# EAGLE schematic io (EAGLE 5.12)

## Sheet 1 of 6
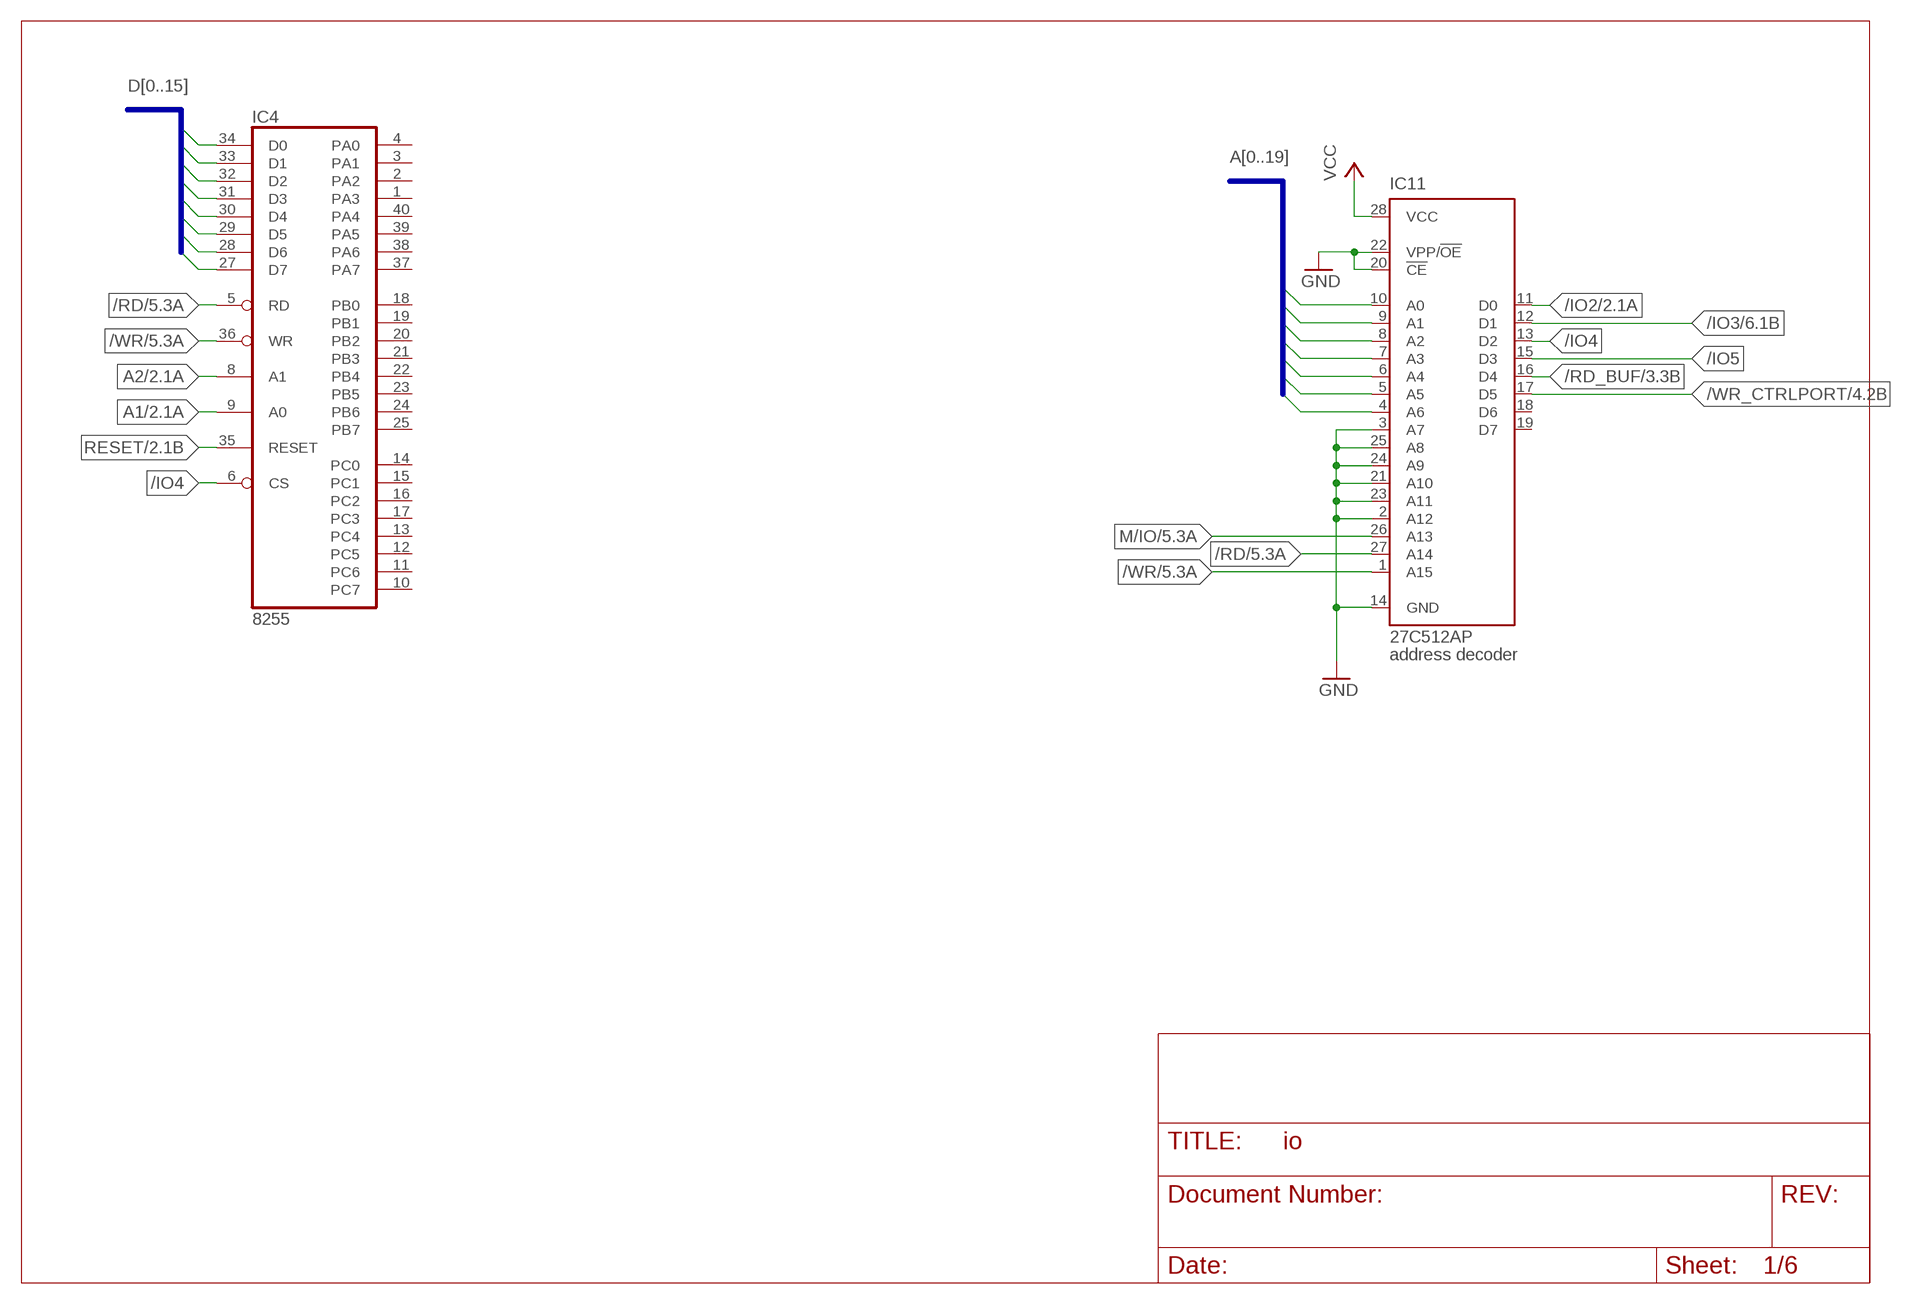
[diagram p0: schematic, sheet 1]

### Parts
IC4  8255  8255A  [DIL40]
IC11  27C512AP  [DIL28-6]

### Nets
/IO2: IC11.11(D0) ; also sheet 2
/IO3: IC11.12(D1) ; also sheet 6
/IO4: IC4.6(CS) IC11.13(D2)
/IO5: IC11.15(D3)
/RD: IC4.5(RD) IC11.27(A14) ; also sheet 5,6
/RD_BUF: IC11.16(D4) ; also sheet 3
/WR: IC4.36(WR) IC11.1(A15) ; also sheet 5,6
/WR_CTRLPORT: IC11.17(D5) ; also sheet 4
A1: IC4.9(A0) ; also sheet 2,3,5,6
A2: IC4.8(A1) ; also sheet 2,3,5
A3: IC11.10(A0) ; also sheet 2,3,5
A4: IC11.9(A1) ; also sheet 3,5
A5: IC11.8(A2) ; also sheet 3,5
A6: IC11.7(A3) ; also sheet 3,5
A7: IC11.6(A4) ; also sheet 3,5
A8: IC11.5(A5) ; also sheet 3,5
A9: IC11.4(A6) ; also sheet 5
D0: IC4.34(D0) ; also sheet 2,3,4,5,6
D1: IC4.33(D1) ; also sheet 2,3,4,5,6
D2: IC4.32(D2) ; also sheet 2,3,4,5,6
D3: IC4.31(D3) ; also sheet 2,3,4,5,6
D4: IC4.30(D4) ; also sheet 2,3,4,5,6
D5: IC4.29(D5) ; also sheet 2,3,4,5,6
D6: IC4.28(D6) ; also sheet 2,3,4,5,6
D7: IC4.27(D7) ; also sheet 2,3,4,5,6
GND: IC11.2(A12) IC11.3(A7) IC11.14(GND) IC11.20(!CE) IC11.21(A10) IC11.22(VPP/!OE) IC11.23(A11) IC11.24(A9) IC11.25(A8) ; also sheet 3,4,5,6
M/IO: IC11.26(A13) ; also sheet 5
RESET: IC4.35(RESET) ; also sheet 2,5,6
VCC: IC11.28(VCC) ; also sheet 3,4,5,6
Unconnected: IC4.1(PA3) IC4.2(PA2) IC4.3(PA1) IC4.4(PA0) IC4.10(PC7) IC4.11(PC6) IC4.12(PC5) IC4.13(PC4) IC4.14(PC0) IC4.15(PC1) IC4.16(PC2) IC4.17(PC3) IC4.18(PB0) IC4.19(PB1) IC4.20(PB2) IC4.21(PB3) IC4.22(PB4) IC4.23(PB5) IC4.24(PB6) IC4.25(PB7) IC4.37(PA7) IC4.38(PA6) IC4.39(PA5) IC4.40(PA4) IC11.18(D6) IC11.19(D7)

### Buses
A[0..19]
D[0..15]

### Notes on the sheet
- address decoder

## Sheet 2 of 6
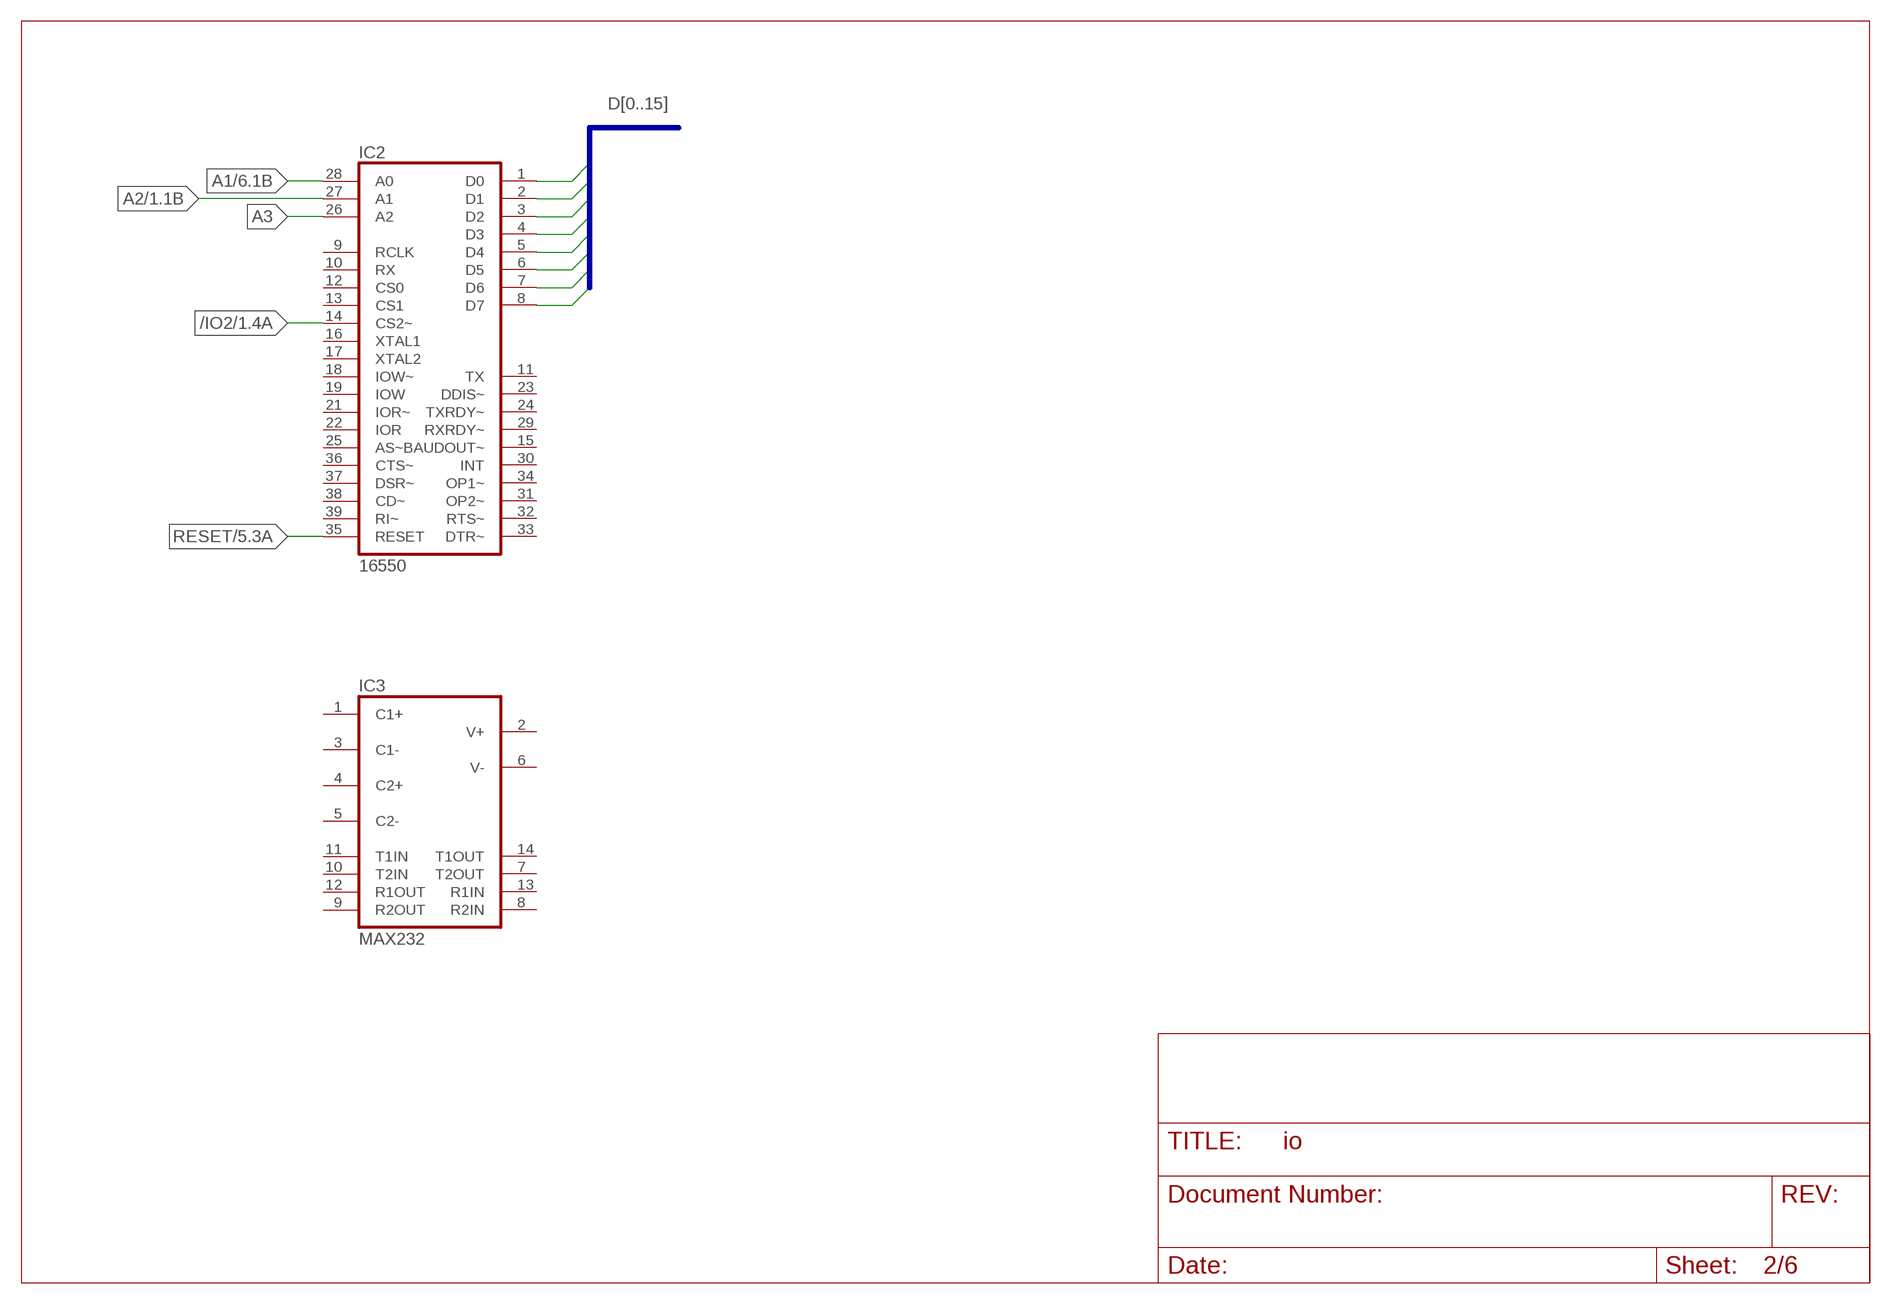
[diagram p1: schematic, sheet 2]

### Parts
IC2  16550  XR-16C550P  [DIL40]
IC3  MAX232  [DIL16]

### Nets
/IO2: IC2.14(CS2~) ; also sheet 1
A1: IC2.28(A0) ; also sheet 1,3,5,6
A2: IC2.27(A1) ; also sheet 1,3,5
A3: IC2.26(A2) ; also sheet 1,3,5
D0: IC2.1(D0) ; also sheet 1,3,4,5,6
D1: IC2.2(D1) ; also sheet 1,3,4,5,6
D2: IC2.3(D2) ; also sheet 1,3,4,5,6
D3: IC2.4(D3) ; also sheet 1,3,4,5,6
D4: IC2.5(D4) ; also sheet 1,3,4,5,6
D5: IC2.6(D5) ; also sheet 1,3,4,5,6
D6: IC2.7(D6) ; also sheet 1,3,4,5,6
D7: IC2.8(D7) ; also sheet 1,3,4,5,6
RESET: IC2.35(RESET) ; also sheet 1,5,6
Unconnected: IC2.9(RCLK) IC2.10(RX) IC2.11(TX) IC2.12(CS0) IC2.13(CS1) IC2.15(BAUDOUT~) IC2.16(XTAL1) IC2.17(XTAL2) IC2.18(IOW~) IC2.19(IOW) IC2.21(IOR~) IC2.22(IOR) IC2.23(DDIS~) IC2.24(TXRDY~) IC2.25(AS~) IC2.29(RXRDY~) IC2.30(INT) IC2.31(OP2~) IC2.32(RTS~) IC2.33(DTR~) IC2.34(OP1~) IC2.36(CTS~) IC2.37(DSR~) IC2.38(CD~) IC2.39(RI~) IC3.1(C1+) IC3.2(V+) IC3.3(C1-) IC3.4(C2+) IC3.5(C2-) IC3.6(V-) IC3.7(T2OUT) IC3.8(R2IN) IC3.9(R2OUT) IC3.10(T2IN) IC3.11(T1IN) IC3.12(R1OUT) IC3.13(R1IN) IC3.14(T1OUT)

### Buses
D[0..15]

## Sheet 3 of 6
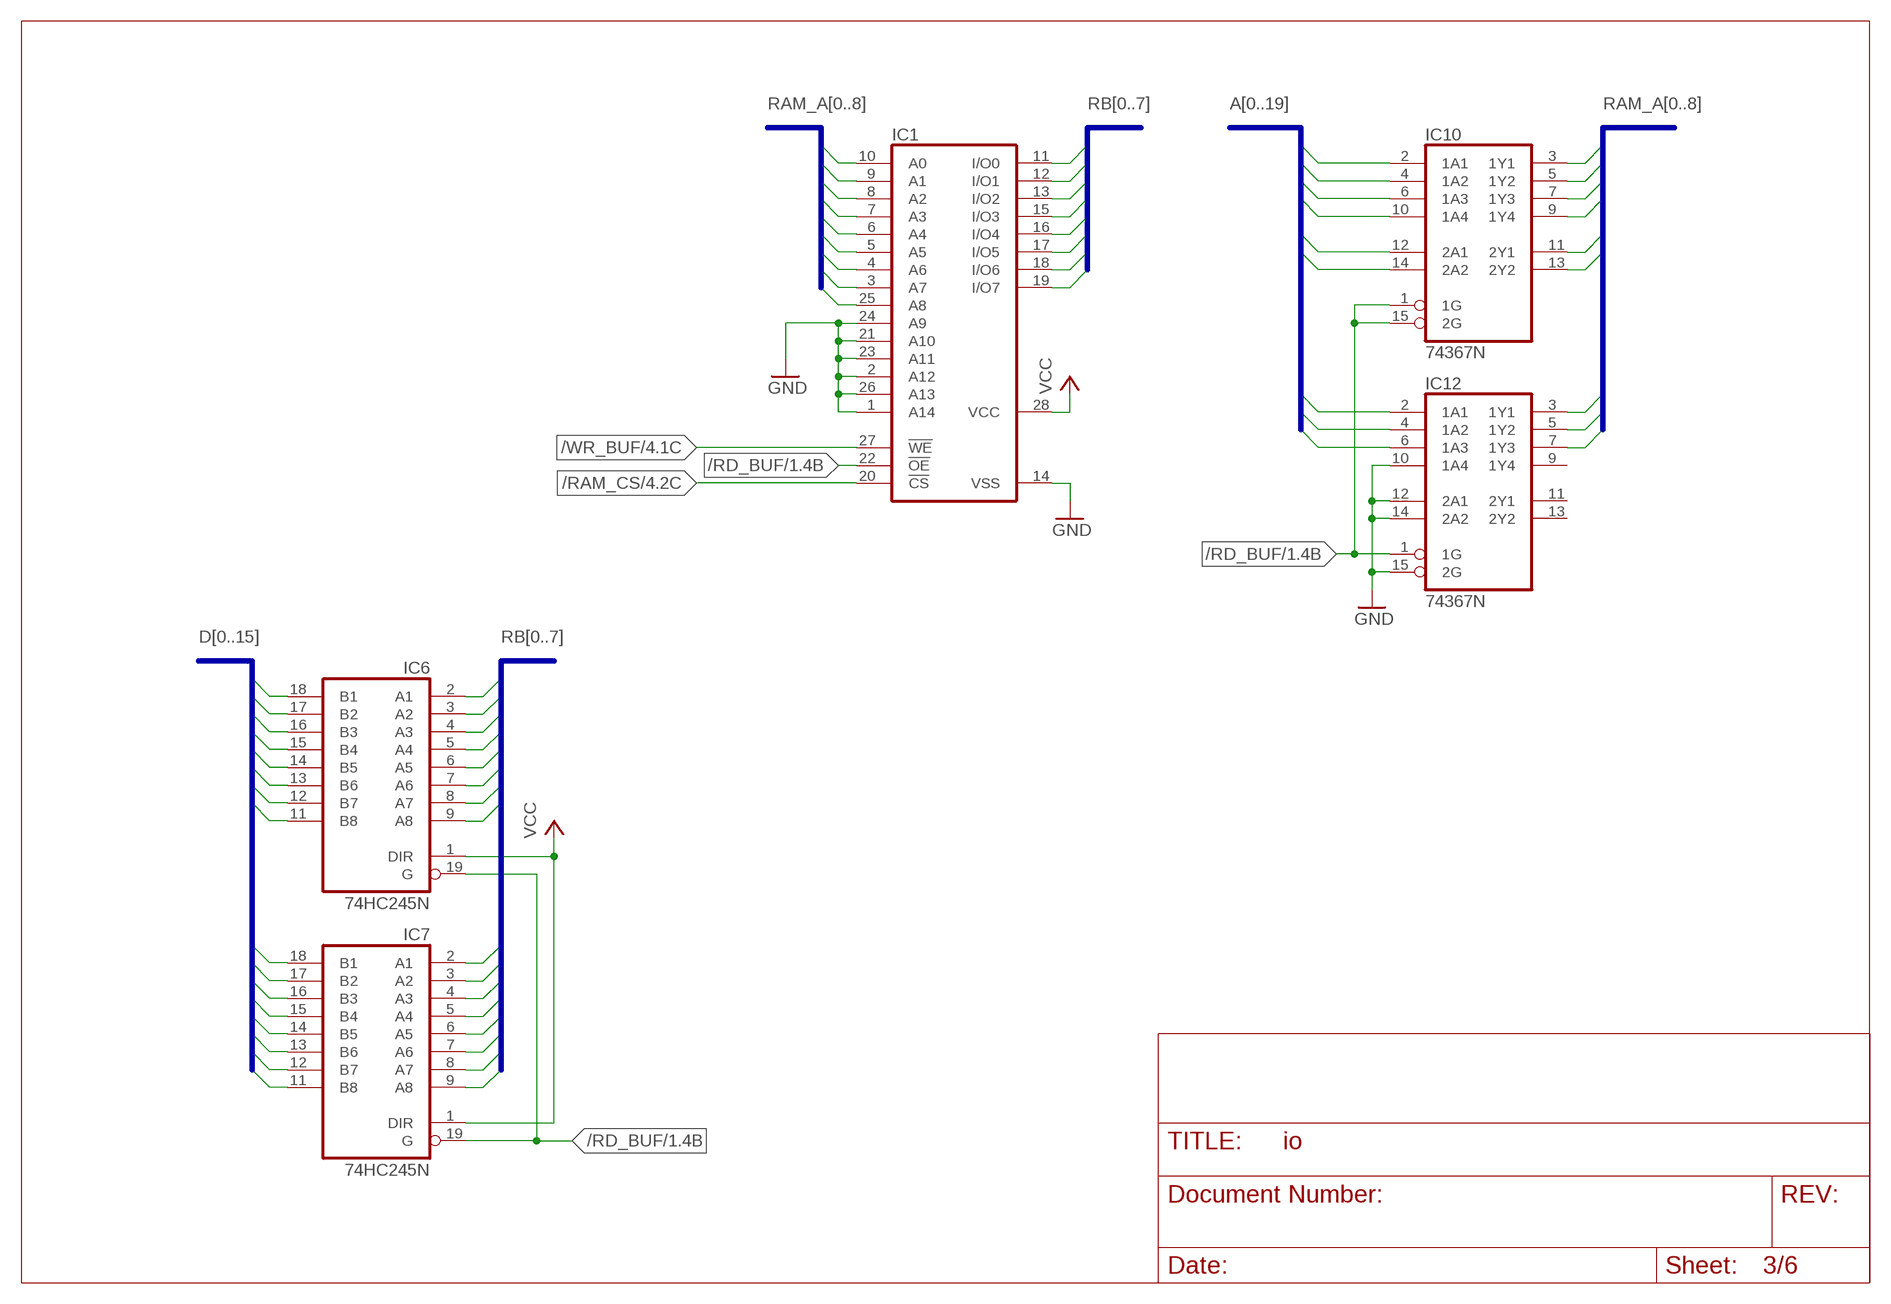
[diagram p2: schematic, sheet 3]

### Parts
IC1  62832P  [DIL28-3]
IC6  74HC245N  [DIL20]
IC7  74HC245N  [DIL20]
IC10  74367N  [DIL16]
IC12  74367N  [DIL16]

### Nets
/RAM_CS: IC1.20(!CS) ; also sheet 4
/RD_BUF: IC1.22(!OE) IC6.19(G) IC7.19(G) IC10.1(1G) IC10.15(2G) IC12.1(1G) ; also sheet 1
/WR_BUF: IC1.27(!WE) ; also sheet 4
A0: IC10.2(1A1) ; also sheet 5
A1: IC10.4(1A2) ; also sheet 1,2,5,6
A2: IC10.6(1A3) ; also sheet 1,2,5
A3: IC10.10(1A4) ; also sheet 1,2,5
A4: IC10.12(2A1) ; also sheet 1,5
A5: IC10.14(2A2) ; also sheet 1,5
A6: IC12.2(1A1) ; also sheet 1,5
A7: IC12.4(1A2) ; also sheet 1,5
A8: IC12.6(1A3) ; also sheet 1,5
D0: IC6.18(B1) ; also sheet 1,2,4,5,6
D1: IC6.17(B2) ; also sheet 1,2,4,5,6
D2: IC6.16(B3) ; also sheet 1,2,4,5,6
D3: IC6.15(B4) ; also sheet 1,2,4,5,6
D4: IC6.14(B5) ; also sheet 1,2,4,5,6
D5: IC6.13(B6) ; also sheet 1,2,4,5,6
D6: IC6.12(B7) ; also sheet 1,2,4,5,6
D7: IC6.11(B8) ; also sheet 1,2,4,5,6
D8: IC7.18(B1) ; also sheet 5
D9: IC7.17(B2) ; also sheet 5
D10: IC7.16(B3) ; also sheet 5
D11: IC7.15(B4) ; also sheet 5
D12: IC7.14(B5) ; also sheet 5
D13: IC7.13(B6) ; also sheet 5
D14: IC7.12(B7) ; also sheet 5
D15: IC7.11(B8) ; also sheet 5
GND: IC1.1(A14) IC1.2(A12) IC1.14(VSS) IC1.21(A10) IC1.23(A11) IC1.24(A9) IC1.26(A13) IC12.10(1A4) IC12.12(2A1) IC12.14(2A2) IC12.15(2G) ; also sheet 1,4,5,6
RAM_A0: IC1.10(A0) IC10.3(1Y1)
RAM_A1: IC1.9(A1) IC10.5(1Y2)
RAM_A2: IC1.8(A2) IC10.7(1Y3)
RAM_A3: IC1.7(A3) IC10.9(1Y4)
RAM_A4: IC1.6(A4) IC10.11(2Y1)
RAM_A5: IC1.5(A5) IC10.13(2Y2)
RAM_A6: IC1.4(A6) IC12.3(1Y1)
RAM_A7: IC1.3(A7) IC12.5(1Y2)
RAM_A8: IC1.25(A8) IC12.7(1Y3)
RB0: IC1.11(I/O0) IC6.2(A1) IC7.2(A1) ; also sheet 4
RB1: IC1.12(I/O1) IC6.3(A2) IC7.3(A2) ; also sheet 4
RB2: IC1.13(I/O2) IC6.4(A3) IC7.4(A3) ; also sheet 4
RB3: IC1.15(I/O3) IC6.5(A4) IC7.5(A4) ; also sheet 4
RB4: IC1.16(I/O4) IC6.6(A5) IC7.6(A5) ; also sheet 4
RB5: IC1.17(I/O5) IC6.7(A6) IC7.7(A6) ; also sheet 4
RB6: IC1.18(I/O6) IC6.8(A7) IC7.8(A7) ; also sheet 4
RB7: IC1.19(I/O7) IC6.9(A8) IC7.9(A8) ; also sheet 4
VCC: IC1.28(VCC) IC6.1(DIR) IC7.1(DIR) ; also sheet 1,4,5,6
Unconnected: IC12.9(1Y4) IC12.11(2Y1) IC12.13(2Y2)

### Buses
D[0..15]
A[0..19]
RAM_A[0..8]
RB[0..7]

## Sheet 4 of 6
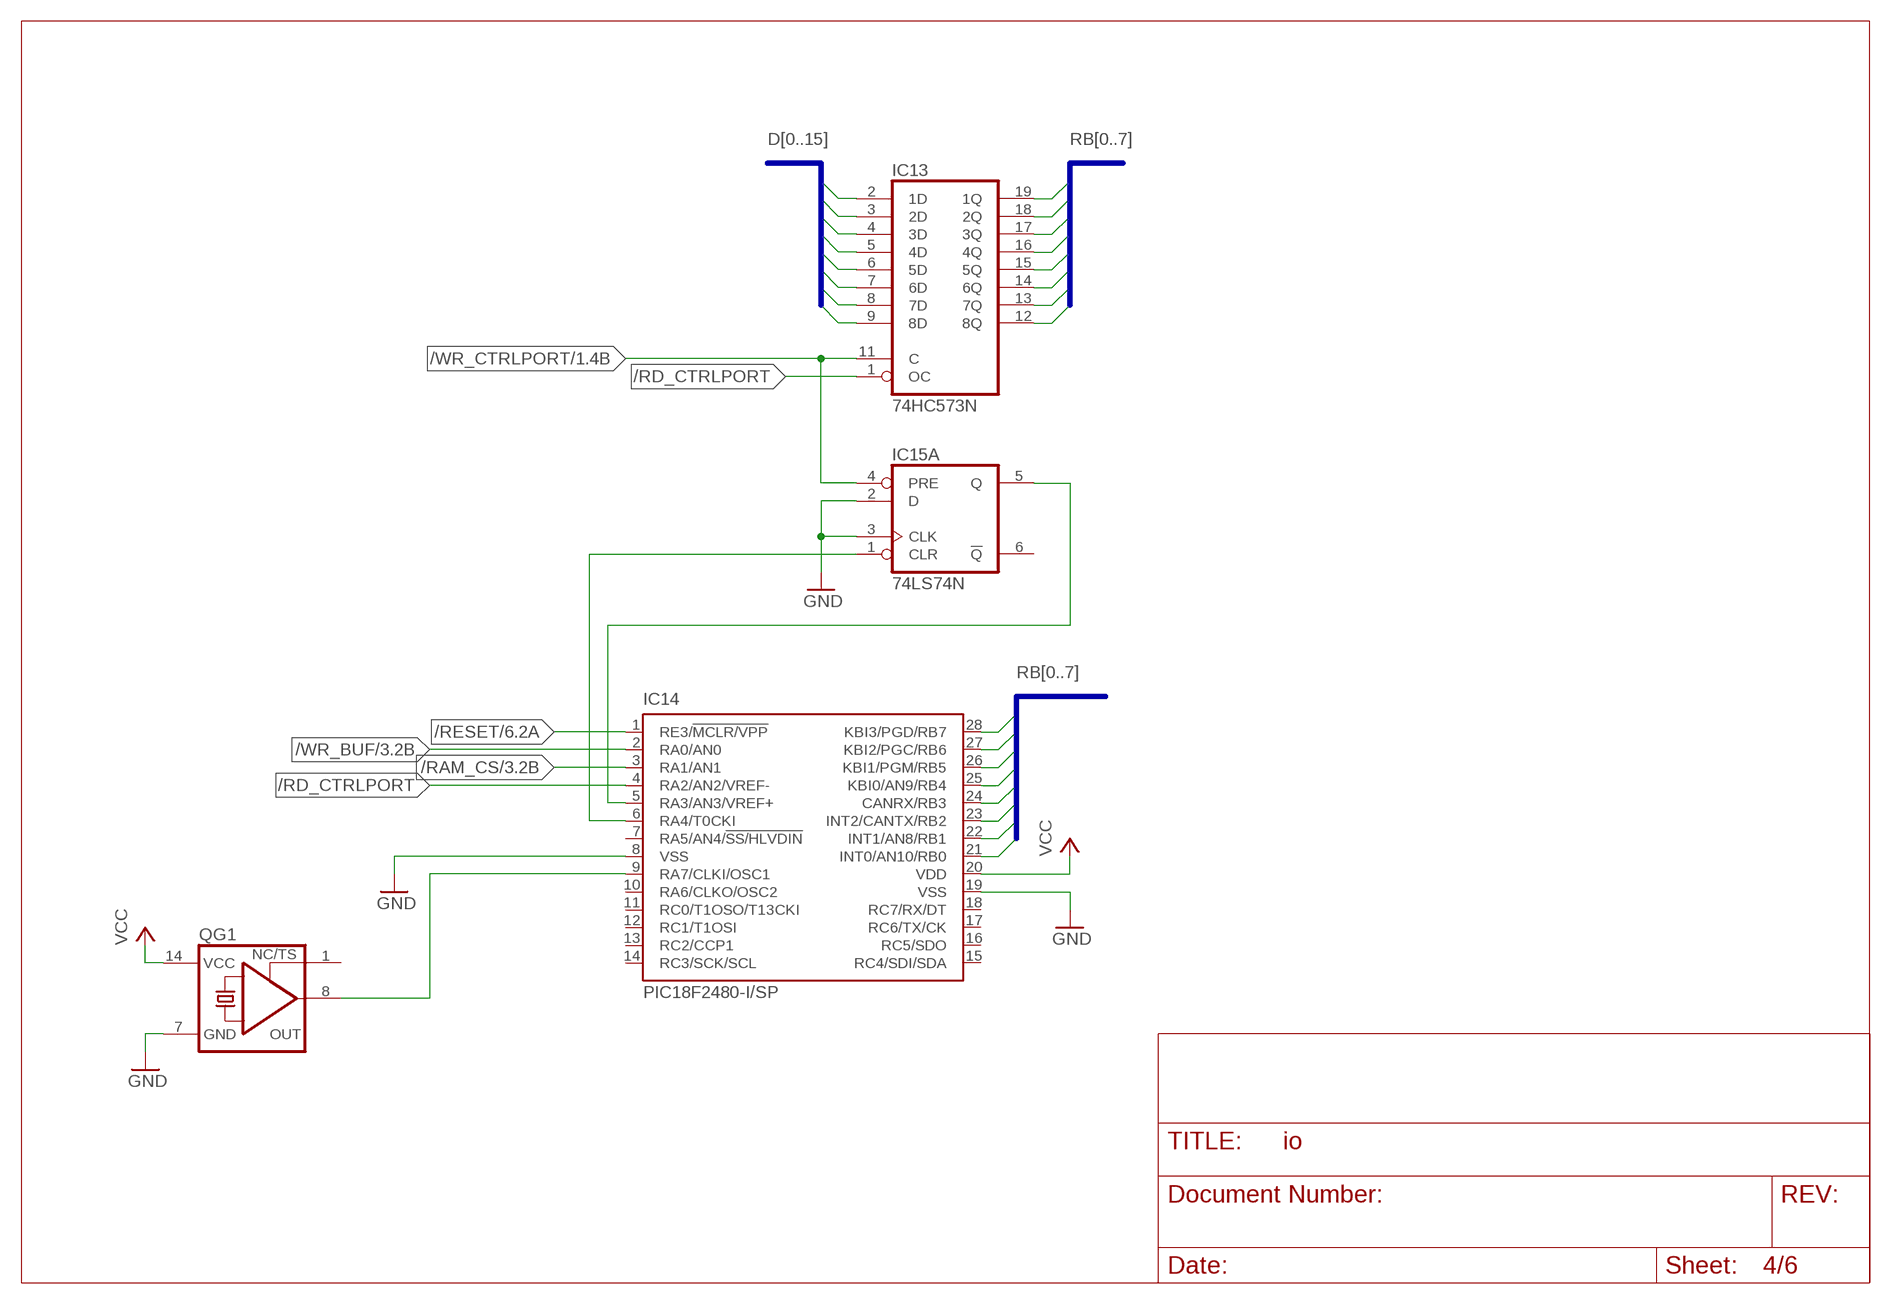
[diagram p3: schematic, sheet 4]

### Parts
IC13  74HC573N  [DIL20]
IC14  PIC18F2480-I/SP  [DIL28-3]
IC15  74LS74N  [DIL14]
QG1  XO-14  [DIL14S]

### Nets
/CLR_PORT_REC: IC14.6(RA4/T0CKI) IC15.1(A:CLR)
/RAM_CS: IC14.3(RA1/AN1) ; also sheet 3
/RD_CTRLPORT: IC13.1(OC) IC14.4(RA2/AN2/VREF-)
/RESET: IC14.1(RE3/!MCLR/VPP) ; also sheet 6
/WR_BUF: IC14.2(RA0/AN0) ; also sheet 3
/WR_CTRLPORT: IC13.11(C) IC15.4(A:PRE) ; also sheet 1
D0: IC13.2(1D) ; also sheet 1,2,3,5,6
D1: IC13.3(2D) ; also sheet 1,2,3,5,6
D2: IC13.4(3D) ; also sheet 1,2,3,5,6
D3: IC13.5(4D) ; also sheet 1,2,3,5,6
D4: IC13.6(5D) ; also sheet 1,2,3,5,6
D5: IC13.7(6D) ; also sheet 1,2,3,5,6
D6: IC13.8(7D) ; also sheet 1,2,3,5,6
D7: IC13.9(8D) ; also sheet 1,2,3,5,6
GND: IC14.8(VSS) IC14.19(VSS) IC15.2(A:D) IC15.3(A:CLK) QG1.7(GND) ; also sheet 1,3,5,6
N$30: IC14.9(RA7/CLKI/OSC1) QG1.8(OUT)
PORT_REC: IC14.5(RA3/AN3/VREF+) IC15.5(A:Q)
RB0: IC13.19(1Q) ; also sheet 3
RB1: IC13.18(2Q) ; also sheet 3
RB2: IC13.17(3Q) ; also sheet 3
RB3: IC13.16(4Q) ; also sheet 3
RB4: IC13.15(5Q) ; also sheet 3
RB5: IC13.14(6Q) ; also sheet 3
RB6: IC13.13(7Q) ; also sheet 3
RB7: IC13.12(8Q) ; also sheet 3
VCC: IC14.20(VDD) QG1.14(VCC) ; also sheet 1,3,5,6
Unconnected: IC14.7(RA5/AN4/!SS/HLVDIN) IC14.10(RA6/CLKO/OSC2) IC14.11(RC0/T1OSO/T13CKI) IC14.12(RC1/T1OSI) IC14.13(RC2/CCP1) IC14.14(RC3/SCK/SCL) IC14.15(RC4/SDI/SDA) IC14.16(RC5/SDO) IC14.17(RC6/TX/CK) IC14.18(RC7/RX/DT) IC14.21(INT0/AN10/RB0) IC14.22(INT1/AN8/RB1) IC14.23(INT2/CANTX/RB2) IC14.24(CANRX/RB3) IC14.25(KBI0/AN9/RB4) IC14.26(KBI1/PGM/RB5) IC14.27(KBI2/PGC/RB6) IC14.28(KBI3/PGD/RB7) IC15.6(A:!Q) IC15.8(B:!Q) IC15.9(B:Q) IC15.10(B:PRE) IC15.11(B:CLK) IC15.12(B:D) IC15.13(B:CLR) QG1.1(TS)

### Buses
D[0..15]
RB[0..7]

## Sheet 5 of 6
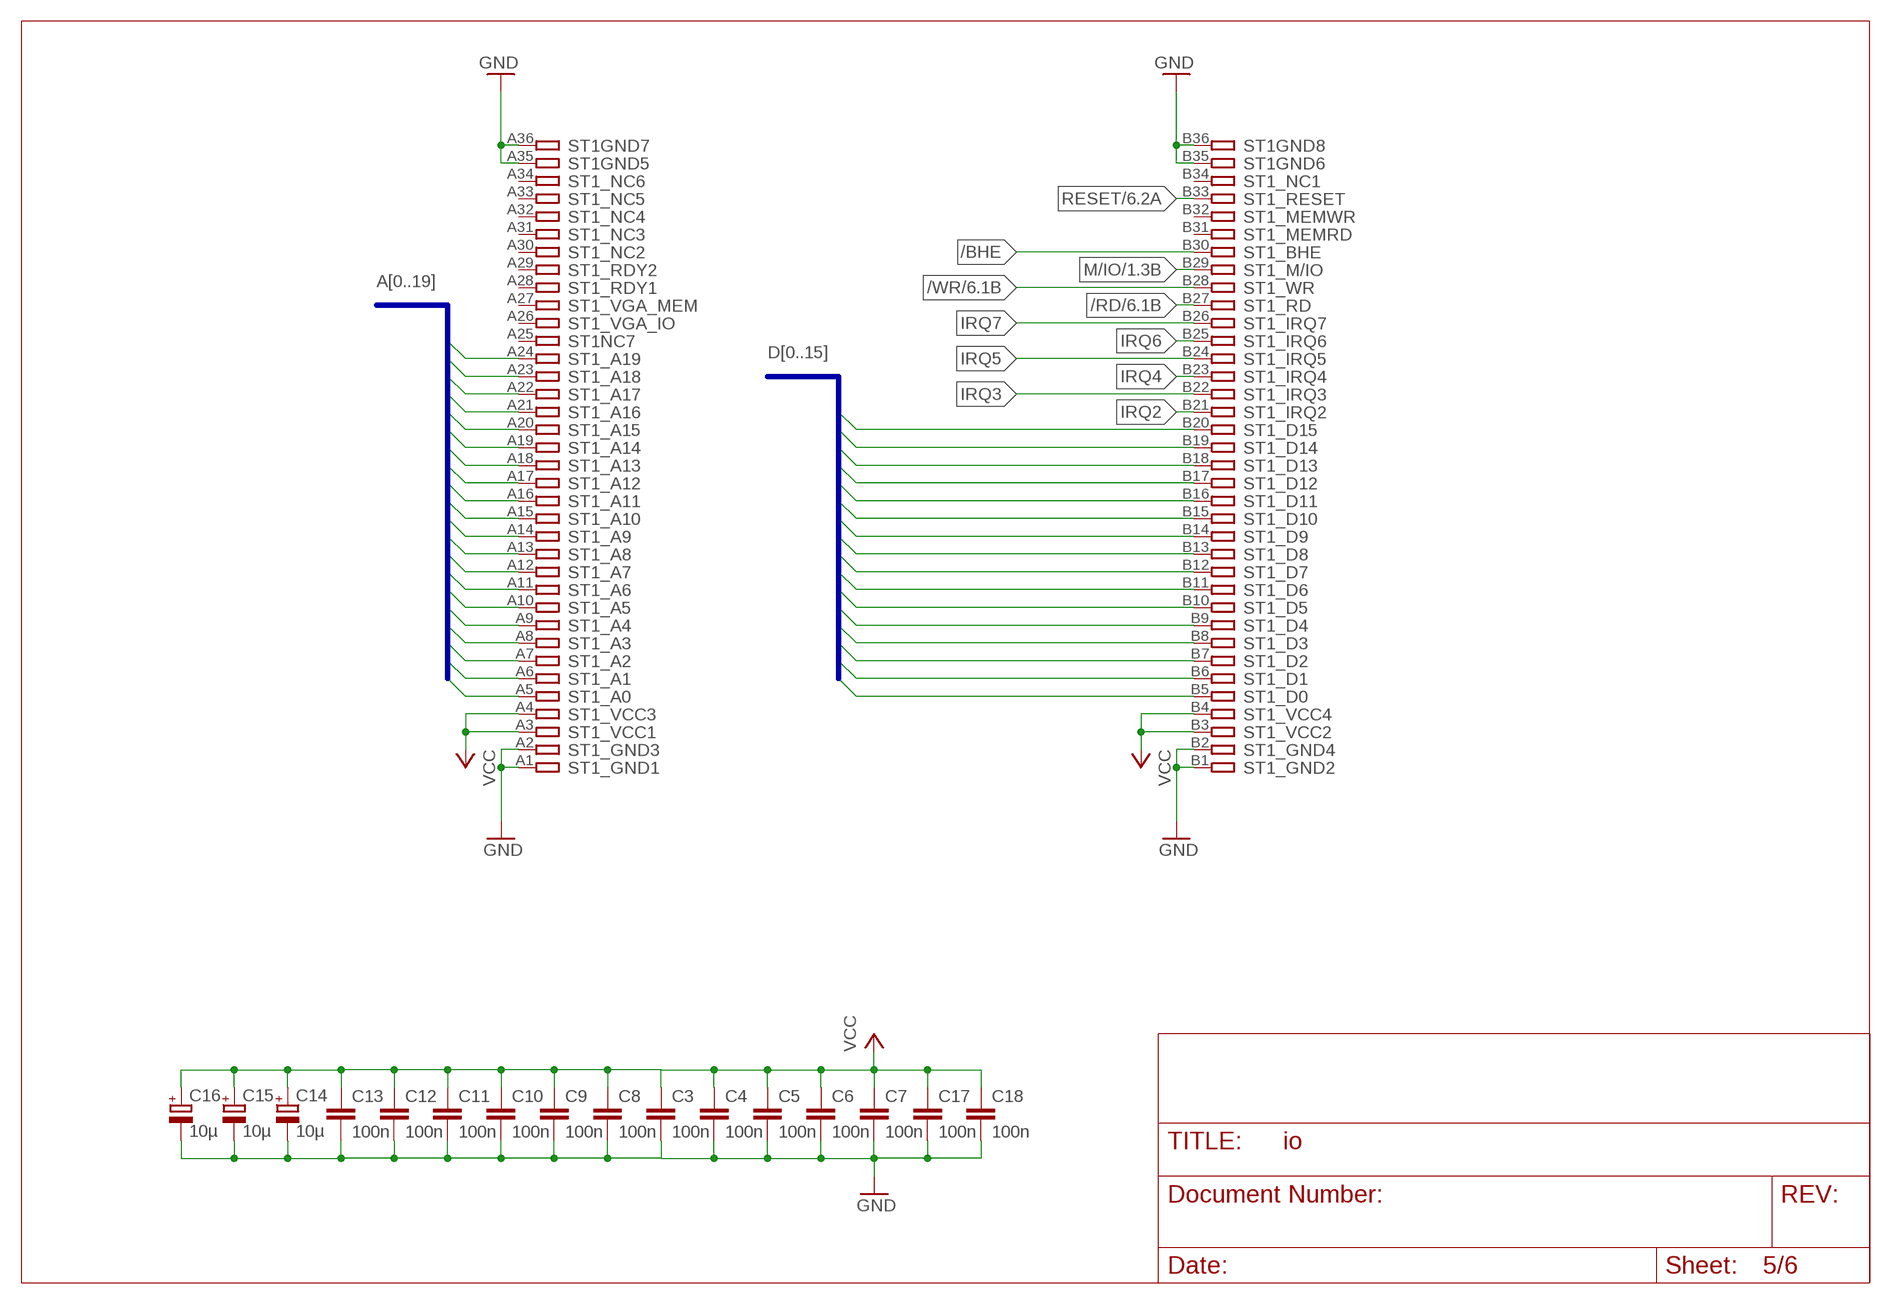
[diagram p4: schematic, sheet 5]

### Parts
C3  100n  C-EU050-024X044  [C050-024X044]
C4  100n  C-EU050-024X044  [C050-024X044]
C5  100n  C-EU050-024X044  [C050-024X044]
C6  100n  C-EU050-024X044  [C050-024X044]
C7  100n  C-EU050-024X044  [C050-024X044]
C8  100n  C-EU050-024X044  [C050-024X044]
C9  100n  C-EU050-024X044  [C050-024X044]
C10  100n  C-EU050-024X044  [C050-024X044]
C11  100n  C-EU050-024X044  [C050-024X044]
C12  100n  C-EU050-024X044  [C050-024X044]
C13  100n  C-EU050-024X044  [C050-024X044]
C14  10µ  CPOL-EUE2-4  [E2-4]
C15  10µ  CPOL-EUE2-4  [E2-4]
C16  10µ  CPOL-EUE2-4  [E2-4]
C17  100n  C-EU050-024X044  [C050-024X044]
C18  100n  C-EU050-024X044  [C050-024X044]
ST1  MINI8086_EDGE  [MINI8086_CON]

### Nets
/BHE: ST1.B30
/RD: ST1.B27 ; also sheet 1,6
/WR: ST1.B28 ; also sheet 1,6
A0: ST1.A5 ; also sheet 3
A1: ST1.A6 ; also sheet 1,2,3,6
A2: ST1.A7 ; also sheet 1,2,3
A3: ST1.A8 ; also sheet 1,2,3
A4: ST1.A9 ; also sheet 1,3
A5: ST1.A10 ; also sheet 1,3
A6: ST1.A11 ; also sheet 1,3
A7: ST1.A12 ; also sheet 1,3
A8: ST1.A13 ; also sheet 1,3
A9: ST1.A14 ; also sheet 1
A10: ST1.A15
A11: ST1.A16
A12: ST1.A17
A13: ST1.A18
A14: ST1.A19
A15: ST1.A20
A16: ST1.A21
A17: ST1.A22
A18: ST1.A23
A19: ST1.A24
D0: ST1.B5 ; also sheet 1,2,3,4,6
D1: ST1.B6 ; also sheet 1,2,3,4,6
D2: ST1.B7 ; also sheet 1,2,3,4,6
D3: ST1.B8 ; also sheet 1,2,3,4,6
D4: ST1.B9 ; also sheet 1,2,3,4,6
D5: ST1.B10 ; also sheet 1,2,3,4,6
D6: ST1.B11 ; also sheet 1,2,3,4,6
D7: ST1.B12 ; also sheet 1,2,3,4,6
D8: ST1.B13 ; also sheet 3
D9: ST1.B14 ; also sheet 3
D10: ST1.B15 ; also sheet 3
D11: ST1.B16 ; also sheet 3
D12: ST1.B17 ; also sheet 3
D13: ST1.B18 ; also sheet 3
D14: ST1.B19 ; also sheet 3
D15: ST1.B20 ; also sheet 3
GND: C3.2 C4.2 C5.2 C6.2 C7.2 C8.2 C9.2 C10.2 C11.2 C12.2 C13.2 C14.- C15.- C16.- C17.2 C18.2 ST1.A1 ST1.A2 ST1.A35 ST1.A36 ST1.B1 ST1.B2 ST1.B35 ST1.B36 ; also sheet 1,3,4,6
IRQ2: ST1.B21
IRQ3: ST1.B22
IRQ4: ST1.B23
IRQ5: ST1.B24
IRQ6: ST1.B25
IRQ7: ST1.B26
M/IO: ST1.B29 ; also sheet 1
RESET: ST1.B33 ; also sheet 1,2,6
VCC: C3.1 C4.1 C5.1 C6.1 C7.1 C8.1 C9.1 C10.1 C11.1 C12.1 C13.1 C14.+ C15.+ C16.+ C17.1 C18.1 ST1.A3 ST1.A4 ST1.B3 ST1.B4 ; also sheet 1,3,4,6
Unconnected: ST1.A25 ST1.A26 ST1.A27 ST1.A28 ST1.A29 ST1.A30 ST1.A31 ST1.A32 ST1.A33 ST1.A34 ST1.B31 ST1.B32 ST1.B34

### Buses
D[0..15]
A[0..19]

## Sheet 6 of 6
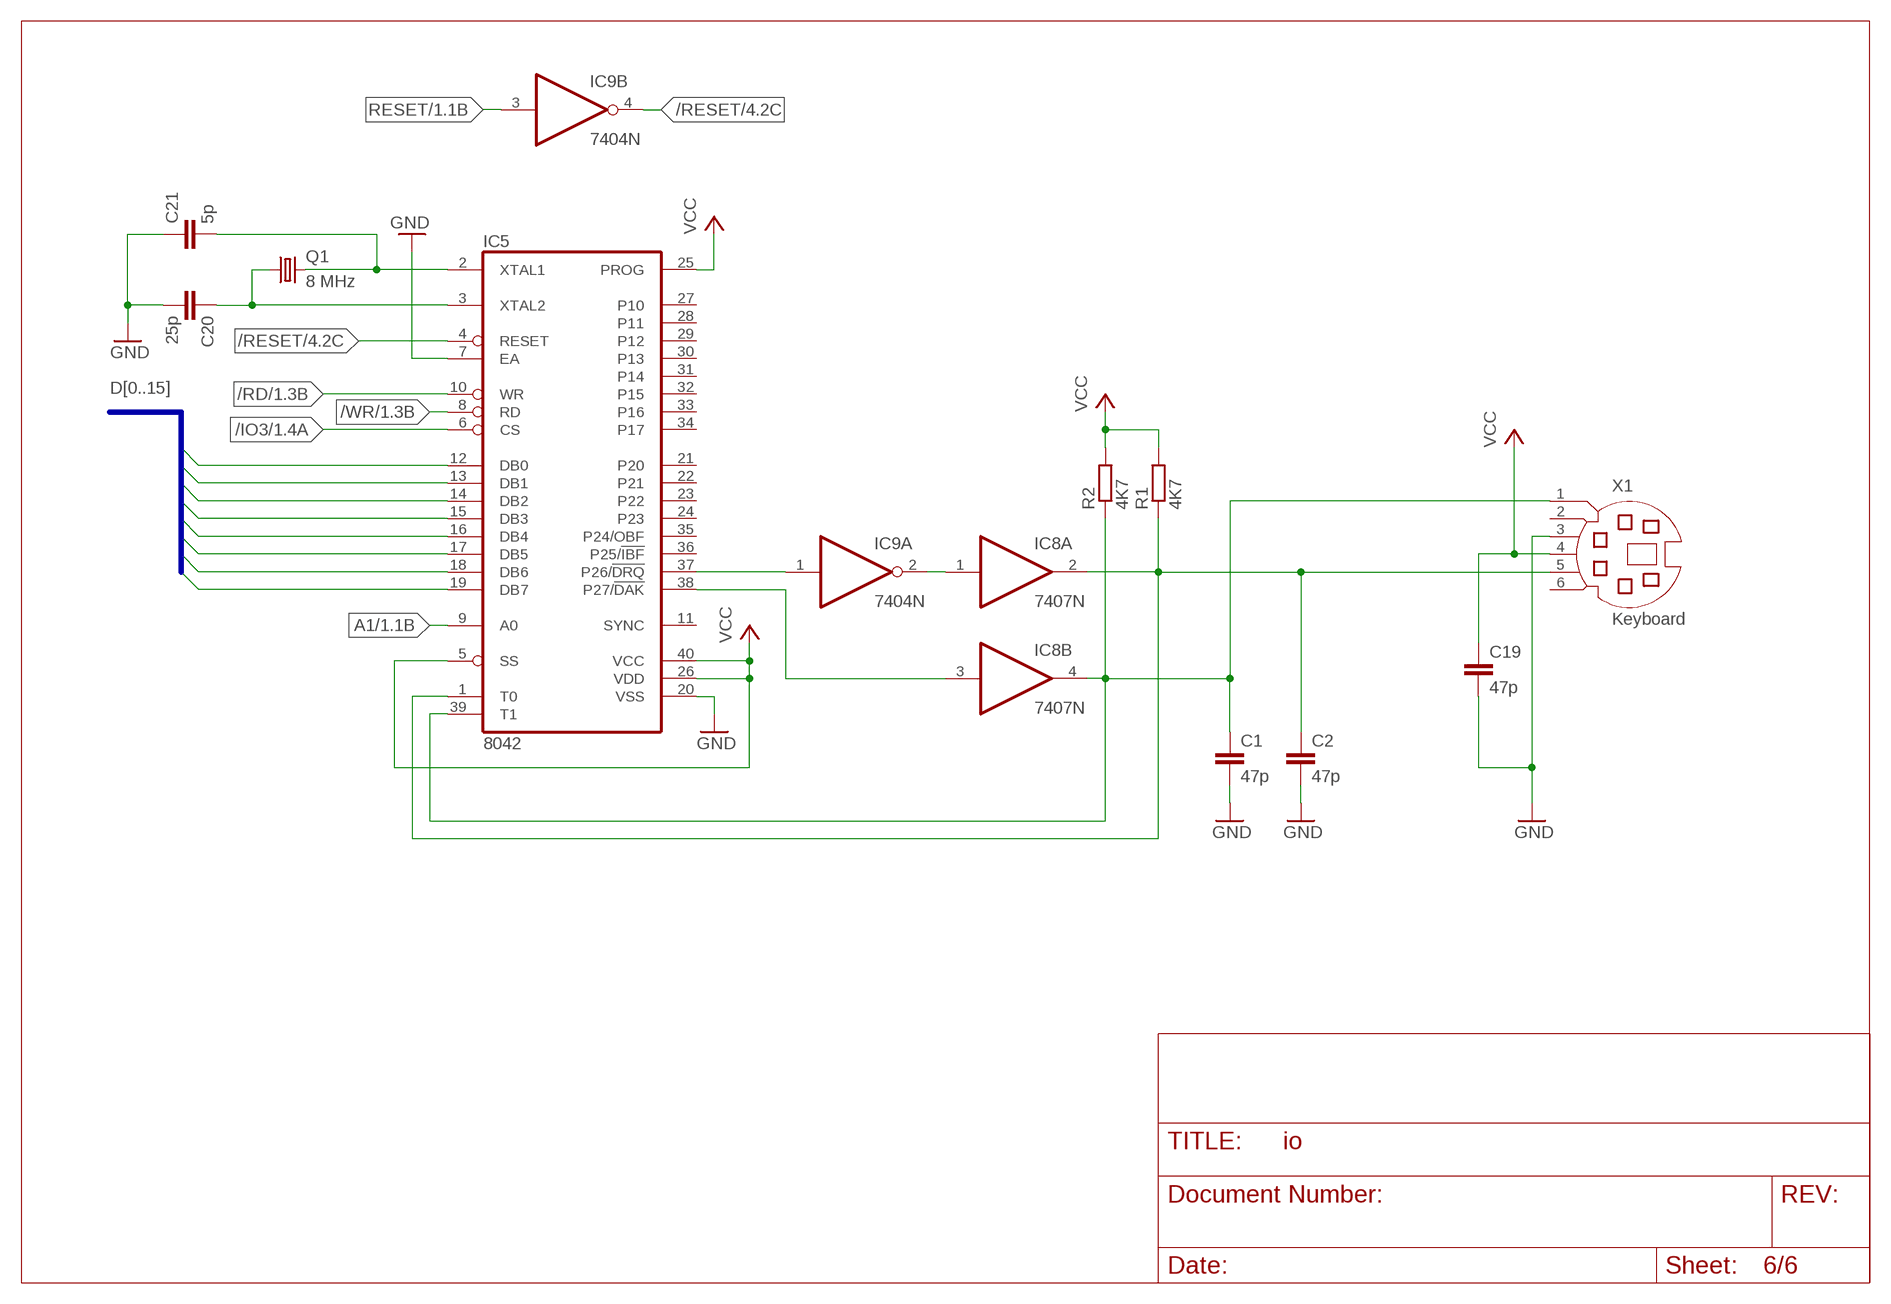
[diagram p5: schematic, sheet 6]

### Parts
C1  47p  C-EU025-025X050  [C025-025X050]
C2  47p  C-EU025-025X050  [C025-025X050]
C19  47p  C-EU025-025X050  [C025-025X050]
C20  25p  C-EU025-024X044  [C025-024X044]
C21  5p  C-EU025-024X044  [C025-024X044]
IC5  8042  UPI-8042AH  [DIL40]
IC8  7407N  [DIL14]
IC9  7404N  [DIL14]
Q1  8 MHz  CRYSTALHC49S  [HC49/S]
R1  4K7  R-EU_0207/7  [0207/7]
R2  4K7  R-EU_0207/7  [0207/7]
X1  Keyboard  MD06S  [MDIN06S]

### Nets
/IO3: IC5.6(CS) ; also sheet 1
/RD: IC5.10(WR) ; also sheet 1,5
/RESET: IC5.4(RESET) IC9.4(B:O) ; also sheet 4
/WR: IC5.8(RD) ; also sheet 1,5
A1: IC5.9(A0) ; also sheet 1,2,3,5
D0: IC5.12(DB0) ; also sheet 1,2,3,4,5
D1: IC5.13(DB1) ; also sheet 1,2,3,4,5
D2: IC5.14(DB2) ; also sheet 1,2,3,4,5
D3: IC5.15(DB3) ; also sheet 1,2,3,4,5
D4: IC5.16(DB4) ; also sheet 1,2,3,4,5
D5: IC5.17(DB5) ; also sheet 1,2,3,4,5
D6: IC5.18(DB6) ; also sheet 1,2,3,4,5
D7: IC5.19(DB7) ; also sheet 1,2,3,4,5
GND: C1.2 C2.2 C19.2 C20.2 C21.1 IC5.7(EA) IC5.20(VSS) X1.3 ; also sheet 1,3,4,5
KBD_CLK: C2.1 IC5.1(T0) IC8.2(A:O) R1.1 X1.5
KBD_DATA: C1.1 IC5.39(T1) IC8.4(B:O) R2.1 X1.1
N$1: IC8.1(A:I) IC9.2(A:O)
N$6: C21.2 IC5.2(XTAL1) Q1.2
N$7: C20.1 IC5.3(XTAL2) Q1.1
P26: IC5.37(P26/!DRQ) IC9.1(A:I)
P27: IC5.38(P27/!DAK) IC8.3(B:I)
RESET: IC9.3(B:I) ; also sheet 1,2,5
VCC: C19.1 IC5.5(SS) IC5.25(PROG) IC5.26(VDD) IC5.40(VCC) R1.2 R2.2 X1.4 ; also sheet 1,3,4,5
Unconnected: IC5.11(SYNC) IC5.21(P20) IC5.22(P21) IC5.23(P22) IC5.24(P23) IC5.27(P10) IC5.28(P11) IC5.29(P12) IC5.30(P13) IC5.31(P14) IC5.32(P15) IC5.33(P16) IC5.34(P17) IC5.35(P24/OBF) IC5.36(P25/!IBF) IC8.5(C:I) IC8.6(C:O) IC8.8(D:O) IC8.9(D:I) IC8.10(E:O) IC8.11(E:I) IC8.12(F:O) IC8.13(F:I) IC9.5(C:I) IC9.6(C:O) IC9.8(D:O) IC9.9(D:I) IC9.10(E:O) IC9.11(E:I) IC9.12(F:O) IC9.13(F:I) X1.2 X1.6

### Buses
D[0..15]

## Power pins joined to a net without a drawn wire
GND: IC2.20(GND) IC3.15(GND) IC4.7(GND) IC6.10(GND) IC7.10(GND) IC8.7(P:GND) IC9.7(P:GND) IC10.8(GND) IC12.8(GND) IC13.10(GND) IC15.7(P:GND)
VCC: IC2.40(VCC) IC3.16(VCC) IC4.26(VCC) IC6.20(VCC) IC7.20(VCC) IC8.14(P:VCC) IC9.14(P:VCC) IC10.16(VCC) IC12.16(VCC) IC13.20(VCC) IC15.14(P:VCC)

## Library data of the parts
C1-C13 C17-C21 = rcl:C-EU: CAPACITOR, European symbol
C14-C16 = rcl:CPOL-EU: POLARIZED CAPACITOR, European symbol
IC1 = memory-hitachi:62832P: MEMORY; OC_FARNELL: unknown; OC_NEWARK: unknown
IC2 = exar:XR-16C550P: UART/FIFO; MPN: ST16C450CP40; OC_FARNELL: 1294801; OC_NEWARK: 24R1445
IC3 = maxim:MAX232: RS232 TRANSEIVER; MF: MAXIM; MPN: MAX232ACPE+; OC_FARNELL: 9723773; OC_NEWARK: 68K4544
IC4 = micro-intel:8255A: MICROCOMPUTER/PERIPHERAL DEVICE; OC_FARNELL: unknown; OC_NEWARK: unknown
IC5 = micro-intel:UPI-8042AH: MICROCOMPUTER/PERIPHERAL DEVICE; OC_FARNELL: unknown; OC_NEWARK: unknown
IC6 IC7 = 74xx-eu:74*245: Octal BUS TRANSCEIVER, 3-state
IC8 = 74xx-us:74*07: Hex BUFFER, open collector high-voltage output
IC9 = 74xx-eu:74*04: Hex INVERTER
IC10 IC12 = 74xx-us:74*367: Hex BUS DRIVER, 3-state
IC11 = microchip:27*512A: CMOS EPROM 512 K (64 K x 8); MPN: M27C512-90B6; OC_FARNELL: 1642690; OC_NEWARK: 20M6389
IC13 = 74xx-eu:74*573: 8-bit D latch BUS DRIVER
IC14 = microchip:PIC18F2*80: 28-Pin Enhanced Flash Microcontrollers with ECAN(TM) Technology 10-Bit A/D and nanoWatt Technology Source: http://www.microchip.com .. 39637a.pdf; MF: MICROCHIP; MPN: PIC18F2480-I/SP; OC_FARNELL: 9321217; OC_NEWARK: 71J7237
IC15 = 74xx-us:74*74: Dual D type positive edge triggered FLIP FLOP, preset and clear
Q1 = crystal:CRYSTAL: CRYSTAL; OC_FARNELL: 1667008; OC_NEWARK: unknown
QG1 = crystal:XO-: CRYSTAL; OC_FARNELL: unknown; OC_NEWARK: unknown
R1 R2 = rcl:R-EU_: RESISTOR, European symbol
ST1 = con-mini8086:MINI8086_EDGE: Mini8086 slot connector
X1 = con-yamaichi:MD06S: YAMAICHI CONNECTOR; OC_FARNELL: unknown; OC_NEWARK: unknown